# EasyEDA Pro project Tb66_and_DRV88_Teensy_LFR_PCB.epro, board PCB18
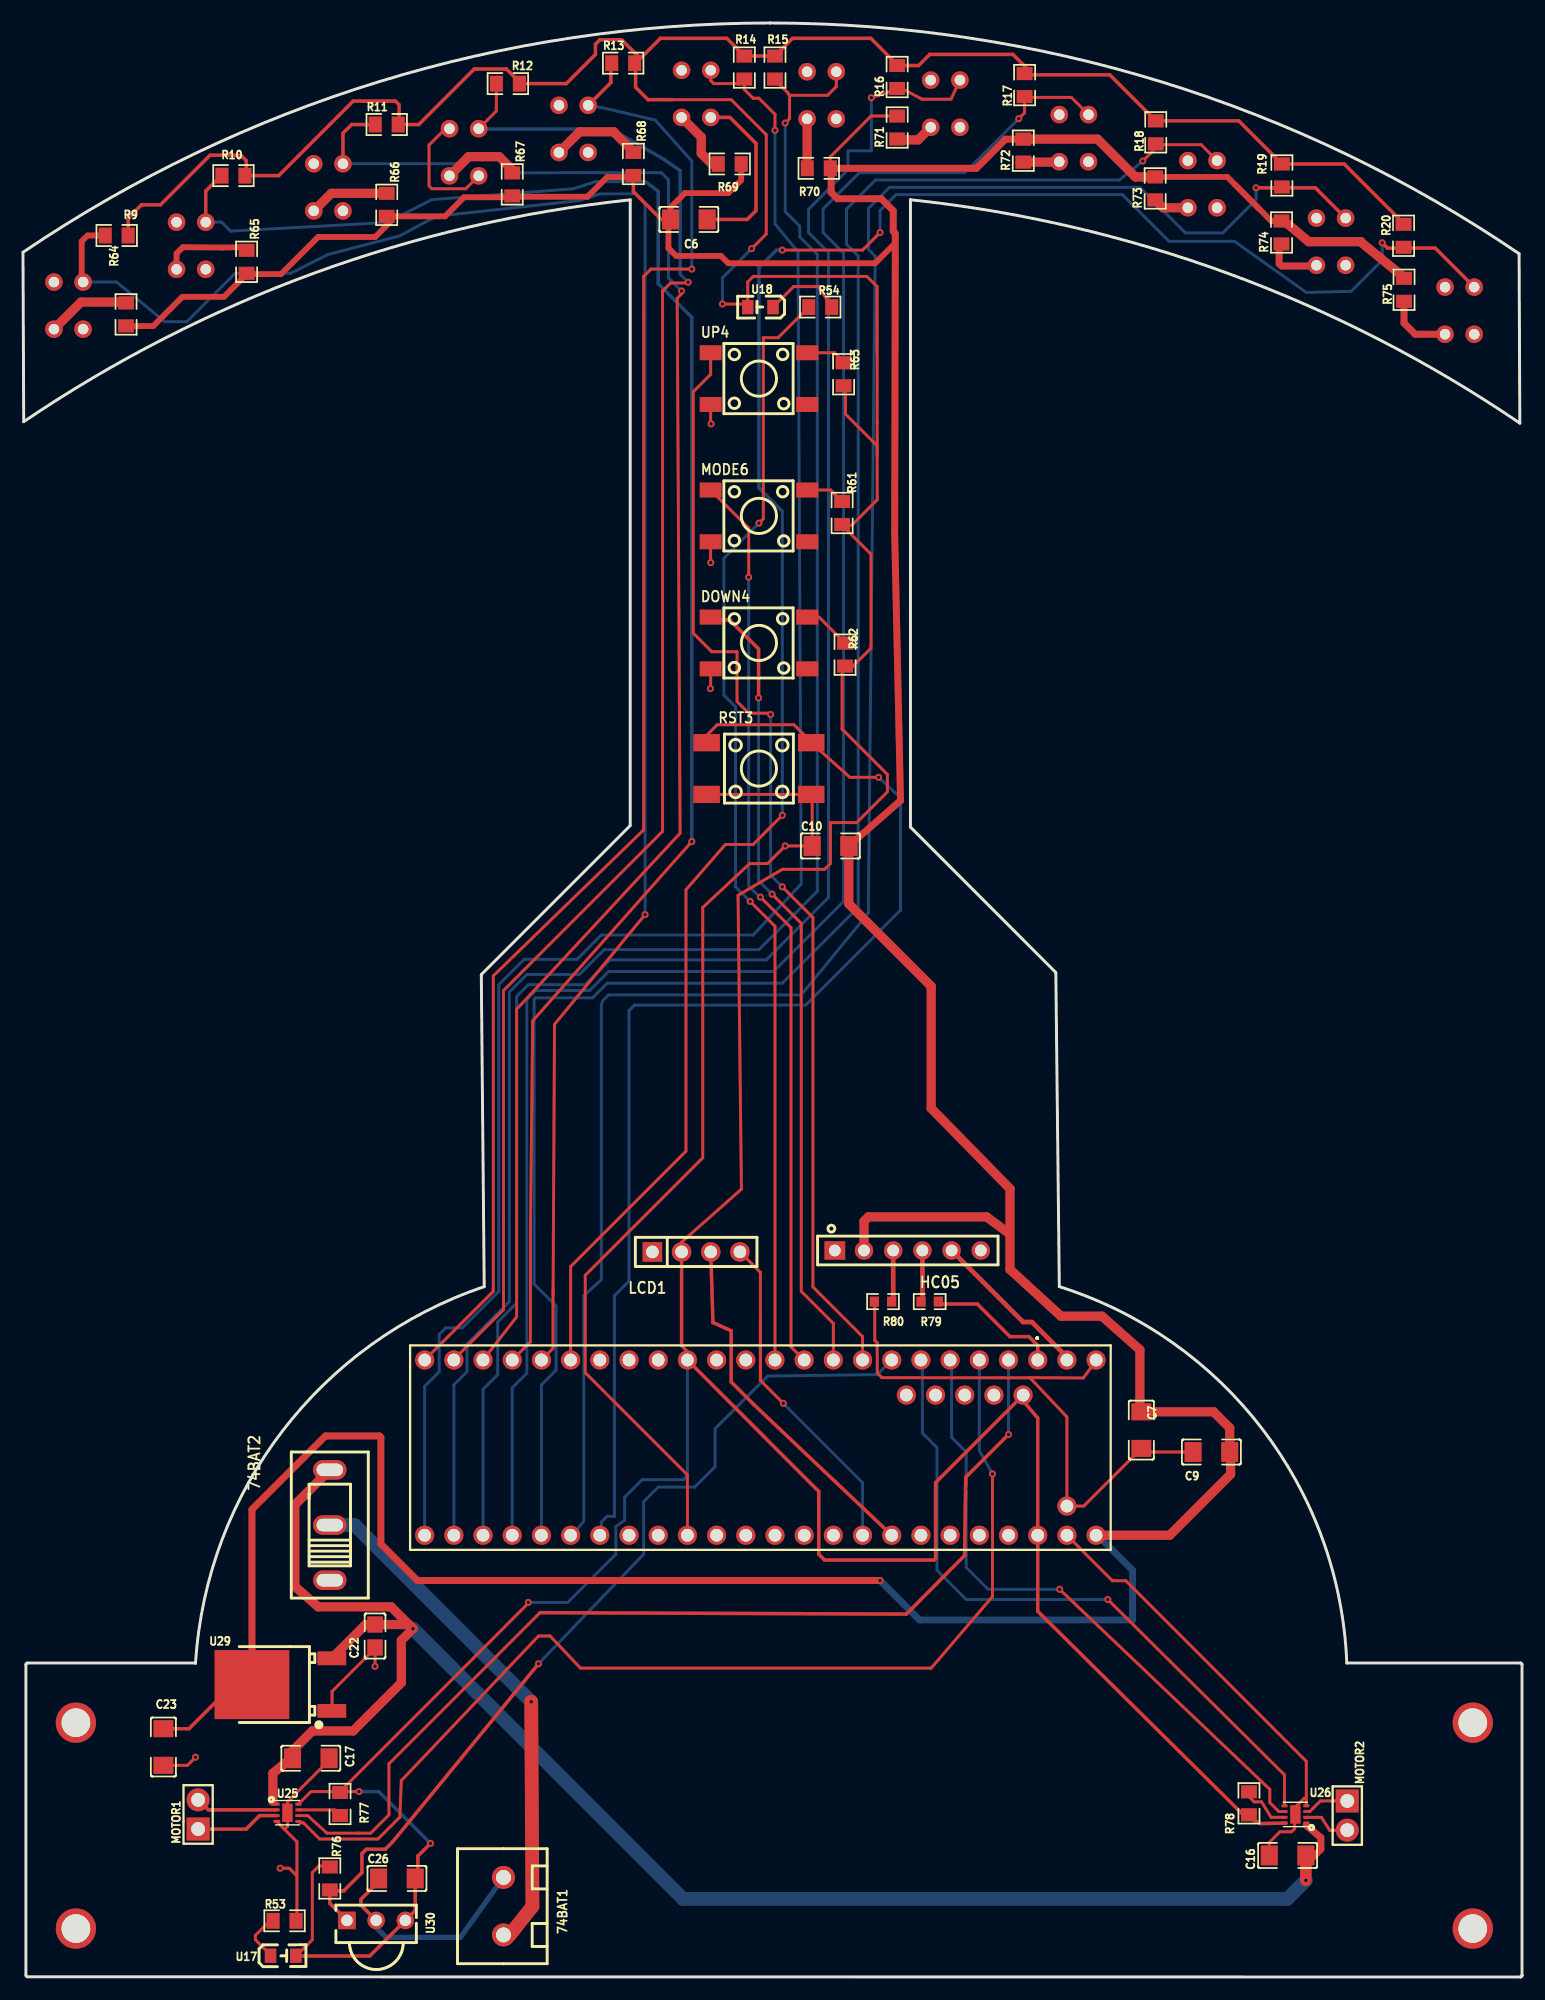
[diagram p6: board, top side]
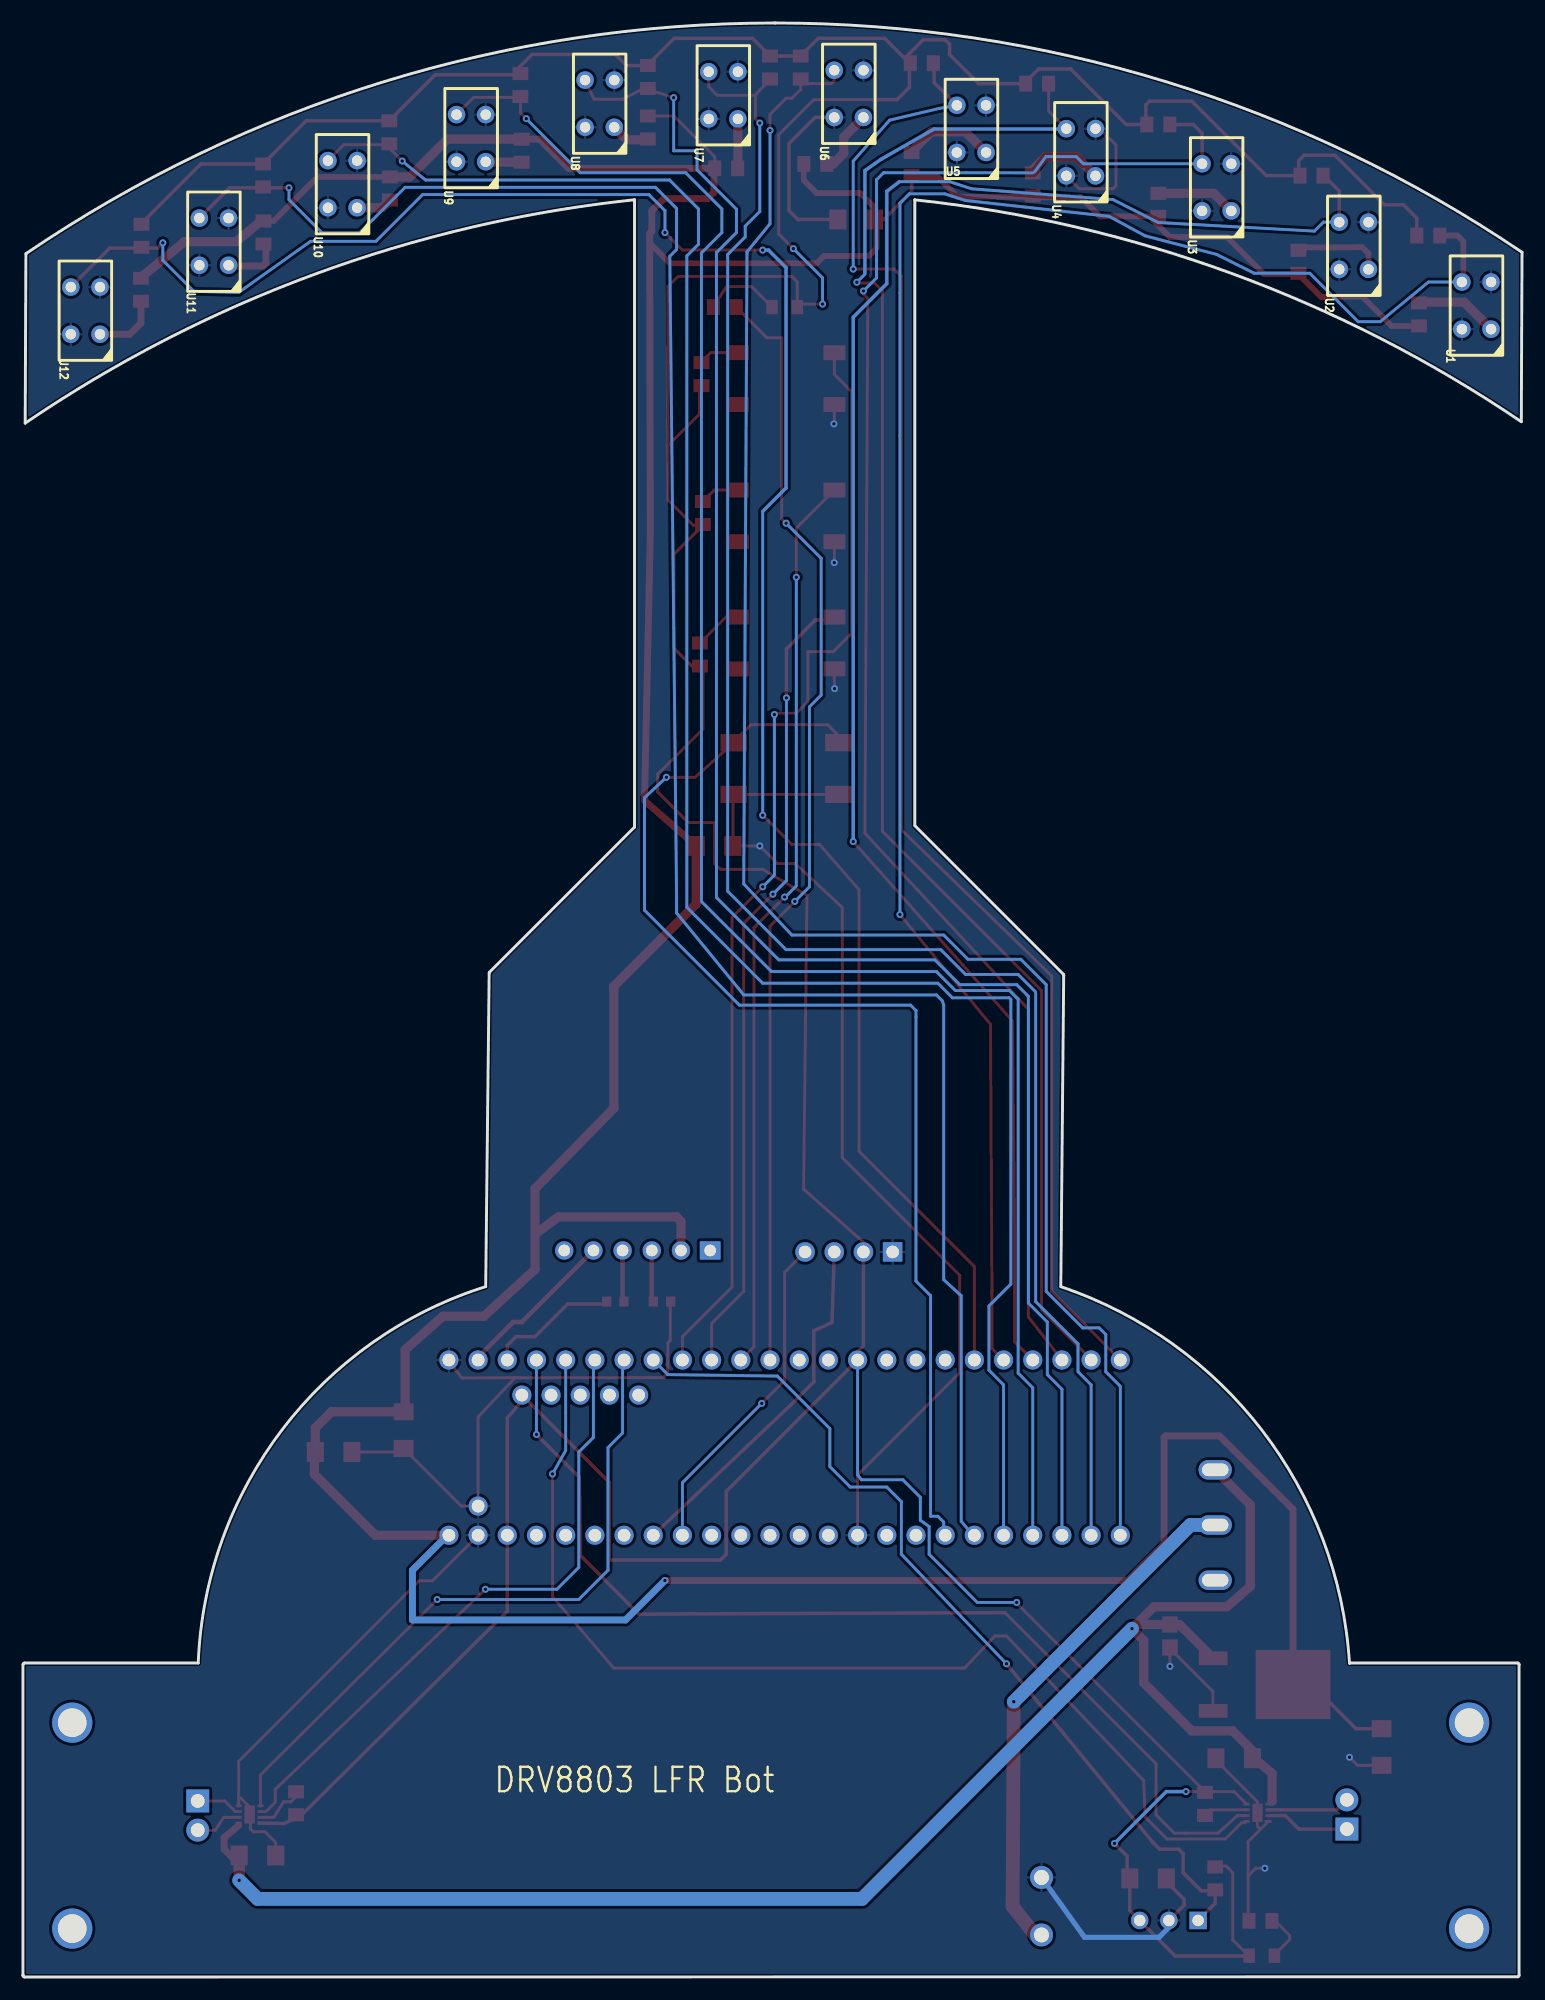
[diagram p7: board, bottom side, seen from below]

Outline 130.43 x 169.93 mm; copper layers: Top Layer, Bottom Layer. Coordinates in mm from the lower left corner of the outline.
Outline path: 0,149.99 arc(31,164.83) 64.99,169.93 arc(99.09,164.8) 130.18,149.86 130.24,135.13 arc(104.93,148.12) 77.22,154.55 77.22,100 89.83,87.39 arc(89.86,87.35) 89.87,87.3 90.17,60.04 arc(107.85,47.63) 115.18,27.3 130.3,27.3 arc(130.39,27.27) 130.43,27.18 130.43,0.18 arc(130.43,0.17) 130.43,0.15 arc(130.43,0.14) 130.43,0.13 arc(130.39,0.04) 130.3,0 0.38,0.02 arc(0.29,0.06) 0.25,0.15 0.25,27.18 arc(0.29,27.27) 0.38,27.3 14.99,27.3 arc(15,27.3) 15.01,27.3 15.01,27.3 arc(22.59,47.49) 40.13,60.03 39.88,87.12 arc(39.88,87.12) 39.88,87.12 arc(39.89,87.17) 39.91,87.21 52.83,100.13 52.83,154.55 arc(25.26,148.15) 0.06,135.25 0,149.99
Stack: Top Layer 0.035mm / Dielectric1 1.51mm FR4 er 4.5 / Bottom Layer 0.035mm

## Design rules (mm)
template: JLCPCB Capability(Two Layers Board)
spacing copperThickness1oz (default): track to track 0.102, other pairs 0.152 to 0.3
spacing copperThickness2oz: track to track 0.203, other pairs 0.152 to 0.3
track width copperThickness1oz (default): min 0.127, default 0.254, max 2.54
track width copperThickness2oz: min 0.203, default 0.254, max 2.54
differential pair differentialPair (default): width min 0.127, default 0.254, max 2.54; gap min 0.152, default 0.152
via viaSize (default): diameter min 0.5, default 0.61, max 10; hole min 0.3, default 0.305, max 6.3

## Placement (name value [footprint] x y rotation side)
74BAT1  7.4V BAT  [CONN-TH_WJ126V-5.0-2P]  41.81 6.16 180 top
74BAT2  SS12D10G4 071  [SW-TH_SHOU-HAN_SS12D10G4]  26.7 39.3 90 top
C6  100nF  [C1206]  57.94 152.84 180 top
C7  100nF  [C1206]  97.31 47.56 90 top
C9  100nF  [C1206]  103.4 45.66 0 top
C10  100nF  [C1206]  70.26 98.36 0 top
C16  100nF  [C1206]  110.03 10.57 0 top
C17  100nF  [C1206]  25.04 19.02 180 top
C22  10uF  [C0805]  30.63 29.65 90 top
C23  47uF  [C1206]  12.22 20 90 top
C26  100nF  [C1206]  32.54 8.57 0 top
DOWN4  TS-1002S-05026C  [KEY-SMD_4P-L6.0-W6.0-P4.50-LS9.0]  64.03 116.01 0 top
HC05  HC-05  [HDR-TH_6P-P2.54-V-F]  76.99 63.18 0 top
LCD1  LCD  [HDR-TH_4P-P2.54-V-F]  58.57 63.05 0 top
MODE6  TS-1002S-05026C  [KEY-SMD_4P-L6.0-W6.0-P4.50-LS9.0]  64.03 127.06 0 top
MOTOR1  MOTOR1  [HDR-TH_2P-P2.54-V-M]  15.24 14.13 90 top
MOTOR2  MOTOR2  [HDR-TH_2P-P2.54-V-M]  115.23 14.04 270 top
NOREF  -  [Pad_e396]  126.14 4.21 0 top
NOREF#2  -  [Pad_e395]  4.6 22.12 0 top
NOREF#3  -  [Pad_e397]  126.14 22.12 0 top
NOREF#4  -  [Pad_e394]  4.6 4.21 0 top
R9  47kΩ  [R0805]  8.15 151.45 180 top
R10  47kΩ  [R0805]  18.31 156.65 0 top
R11  47kΩ  [R0805]  31.65 161.1 0 top
R12  47kΩ  [R0805]  42.19 164.65 180 top
R13  47kΩ  [R0805]  52.22 166.43 0 top
R14  47kΩ  [R0805]  62.76 166.05 90 top
R15  47kΩ  [R0805]  65.43 166.05 270 top
R16  47kΩ  [R0805]  76.06 165.23 90 top
R17  47kΩ  [R0805]  87.15 164.53 90 top
R18  47kΩ  [R0805]  98.56 160.42 270 top
R19  47kΩ  [R0805]  109.54 156.66 90 top
R20  47kΩ  [R0805]  120.12 151.42 90 top
R53  470Ω  [R0805]  22.76 4.89 180 top
R54  470Ω  [R0805]  69.37 145.22 0 top
R61  10kΩ  [R0805]  71.27 127.32 270 top
R62  10kΩ  [R0805]  71.53 115 90 top
R63  10kΩ  [R0805]  71.4 139.38 270 top
R64  187Ω  [R0805]  8.97 144.58 270 top
R65  187Ω  [R0805]  19.46 149.16 270 top
R66  187Ω  [R0805]  31.65 154.11 270 top
R67  187Ω  [R0805]  42.57 155.89 270 top
R68  187Ω  [R0805]  53.11 157.67 270 top
R69  187Ω  [R0805]  61.49 157.67 0 top
R70  187Ω  [R0805]  69.24 157.29 0 top
R71  187Ω  [R0805]  76.06 160.84 90 top
R72  187Ω  [R0805]  87.04 158.82 90 top
R73  187Ω  [R0805]  98.51 155.54 90 top
R74  187Ω  [R0805]  109.51 151.71 90 top
R75  187Ω  [R0805]  120.16 146.73 90 top
R76  10kΩ  [R0805]  26.7 8.57 90 top
R77  10kΩ  [R0805]  27.58 15.05 90 top
R78  10kΩ  [R0805]  106.67 15.1 270 top
R79  1K  [R0603]  78.89 58.74 180 top
R80  2K  [R0603]  74.83 58.74 180 top
RST3  -  [SW-SMD_4P-L6.0-W6.0-P4.50-LS9.0-2]  64.03 105.09 180 top
U1  LTH1550-01  [OPTO-TH_4P-L8.7-W4.5-P4.10_LTH1550-01]  3.96 145.35 90 bottom
U2  LTH1550-01  [OPTO-TH_4P-L8.7-W4.5-P4.10_LTH1550-01]  14.63 150.56 90 bottom
U3  LTH1550-01  [OPTO-TH_4P-L8.7-W4.5-P4.10_LTH1550-01]  26.57 155.64 90 bottom
U4  LTH1550-01  [OPTO-TH_4P-L8.7-W4.5-P4.10_LTH1550-01]  38.38 158.69 90 bottom
U5  LTH1550-01  [OPTO-TH_4P-L8.7-W4.5-P4.10_LTH1550-01]  47.9 160.72 90 bottom
U6  LTH1550-01  [OPTO-TH_4P-L8.7-W4.5-P4.10_LTH1550-01]  58.57 163.76 90 bottom
U7  LTH1550-01  [OPTO-TH_4P-L8.7-W4.5-P4.10_LTH1550-01]  69.49 163.64 90 bottom
U8  LTH1550-01  [OPTO-TH_4P-L8.7-W4.5-P4.10_LTH1550-01]  80.25 162.91 90 bottom
U9  LTH1550-01  [OPTO-TH_4P-L8.7-W4.5-P4.10_LTH1550-01]  91.44 159.91 90 bottom
U10  LTH1550-01  [OPTO-TH_4P-L8.7-W4.5-P4.10_LTH1550-01]  102.63 155.91 90 bottom
U11  LTH1550-01  [OPTO-TH_4P-L8.7-W4.5-P4.10_LTH1550-01]  113.81 150.91 90 bottom
U12  LTH1550-01  [OPTO-TH_4P-L8.7-W4.5-P4.10_LTH1550-01]  125 144.91 90 bottom
U17  YLED0805R  [LED0805-RD]  22.64 1.85 0 top
U18  YLED0805R  [LED0805-RD]  64.16 145.22 180 top
U25  DRV8838DSGR  [WSON-8_L2.0-W2.0-P0.50-TL-EP]  23.01 14.29 0 top
U26  DRV8838DSGR  [WSON-8_L2.0-W2.0-P0.50-TL-EP]  110.71 14.14 180 top
U29  ZLDO1117QK50TC  [TO-252-3_L6.6-W6.1-P4.57-LS9.9-BR-CW]  23.4 25.43 0 top
U30  XL-IRM1838B  [OPTO-TH_3P-L7.0-W5.6-P2.54-L]  30.73 4.92 0 top
U31  TEENSY 4.1  [TEENSY41 solved]  88.29 53.66 180 top
UP4  TS-1002S-05026C  [KEY-SMD_4P-L6.0-W6.0-P4.50-LS9.0]  64.03 139 0 top

## Footprints (pads in the part's own frame, mm; a bottom-side part is the same pattern mirrored in y, then rotated)
C0805
  rect 1.41x1.35 smd: 1(-1,0) 2(1,0)
C1206
  rect 1.485x1.728 smd: 1(-1.593,0) 2(1.593,0)
CONN-TH_WJ126V-5.0-2P
  round 2 hole 1.3: 1(0,2.501) 2(0,-2.501)
HDR-TH_2P-P2.54-V-M
  rect 2x2 hole 1.2: 1(-1.27,0)
  round 2 hole 1.2: 2(1.27,0)
HDR-TH_4P-P2.54-V-F
  rect 1.7x1.7 hole 1.1: 1(-3.81,0)
  round 1.7 hole 1.1: 2(-1.27,0) 3(1.27,0) 4(3.81,0)
HDR-TH_6P-P2.54-V-F
  rect 1.8x1.6 hole 1.02: 1(-6.35,0)
  round 1.6 hole 1.02: 2(-3.81,0) 3(-1.27,0) 4(1.27,0) 5(3.81,0) 6(6.35,0)
KEY-SMD_4P-L6.0-W6.0-P4.50-LS9.0
  rect 1.9x1.3 smd: 1(-4.2,2.25) 2(4.2,2.25) 3(-4.2,-2.25) 4(4.2,-2.25)
LED0805-RD
  rect 1x1.25 smd: 1(-1.1,0) 2(1.1,0)
OPTO-TH_3P-L7.0-W5.6-P2.54-L
  rect 1.524x1.524 hole 1: 1(-2.54,0)
  round 1.524 hole 1: 2(0,0) 3(2.54,0)
OPTO-TH_4P-L8.7-W4.5-P4.10_LTH1550-01
  round 1.524 hole 0.914: 1(-2.05,1.27) 2(2.05,1.27) 3(-2.05,-1.27) 4(2.05,-1.27)
Pad_e394
  round 3.5 hole 2.5: 1(0,0)
Pad_e395
  round 3.5 hole 2.5: 1(0,0)
Pad_e396
  round 3.5 hole 2.5: 2(0,0)
Pad_e397
  round 3.5 hole 2.5: 1(0,0)
R0603
  rect 0.806x0.864 smd: 1(-0.753,0) 2(0.753,0)
R0805
  rect 1.133x1.377 smd: 1(-1,0) 2(1,0)
SW-SMD_4P-L6.0-W6.0-P4.50-LS9.0-2
  rect 2.3x1.5 smd: 1(-4.55,2.25) 2(4.55,2.25) 3(-4.55,-2.25) 4(4.55,-2.25)
SW-TH_SHOU-HAN_SS12D10G4
  oval 1.7x2.9 hole 1.1x2.3: 1(-4.8,0) 2(0,0) 3(4.8,0)
TEENSY41 solved
  round 1.665 hole 1.11: 0(-2.54,0) 1(0,0) 2(2.54,0) 3(5.08,0) 4(7.62,0) 5(10.16,0) 6(12.7,0) 7(15.24,0) 8(17.78,0) 9(20.32,0) 10(22.86,0) 11(25.4,0) 12(27.94,0) 13(27.94,15.24) 14(25.4,15.24) 15(22.86,15.24) 16(20.32,15.24) 17(17.78,15.24) 18(15.24,15.24) 19(12.7,15.24) 20(10.16,15.24) 21(7.62,15.24) 22(5.08,15.24) 23(2.54,15.24) 24(33.02,0) 25(35.56,0) 26(38.1,0) 27(40.64,0) 28(43.18,0) 29(45.72,0) 30(48.26,0) 31(50.8,0) 32(53.34,0) 33(53.34,15.24) 33V(0,15.24) 33V(30.48,0) 34(50.8,15.24) 35(48.26,15.24) 36(45.72,15.24) 37(43.18,15.24) 38(40.64,15.24) 39(38.1,15.24) 40(35.56,15.24) 41(33.02,15.24) 48(11.43,3.05) 49(8.89,3.05) 50(6.35,3.05) 51(3.81,3.05) 52(1.27,3.05) GND(-5.08,0) GND1(-2.54,15.24) GND2(-2.54,12.7) GND3(30.48,15.24) VIN1(-5.08,15.24)
TO-252-3_L6.6-W6.1-P4.57-LS9.9-BR-CW
  rect 2.5x1.2 smd: 1(3.475,-2.286) 3(3.475,2.286)
  rect 6.5x6 smd: 2(-3.475,0)
WSON-8_L2.0-W2.0-P0.50-TL-EP
  rect 0.521x0.25 smd: 1(-0.95,0.75) 2(-0.95,0.25) 3(-0.95,-0.25) 4(-0.95,-0.75) 5(0.95,-0.75) 6(0.95,-0.25) 7(0.95,0.25) 8(0.95,0.75)
  rect 0.9x1.6 smd: 9(0,0)

## Nets
+3.3V: C26.2 LCD1.2 R9.1 R10.2 R11.2 R12.1 R13.2 R14.2 R15.1 R16.2 R17.2 R18.1 R19.2 R20.2 R61.2 R62.1 R63.2 R76.2 R77.2 R78.2 U17.2 U18.2 U25.8 U26.8 U30.3 U31.33V U31.52
+5V: C6.2 C7.2 C9.2 C10.2 C23.2 HC05.2 R64.2 R65.2 R66.2 R67.2 R68.2 R69.2 R70.2 R71.2 R72.2 R73.2 R74.2 R75.2 U29.2 U31.VIN1
+7.4V: 74BAT2.3 C16.2 C17.2 C22.2 U25.1 U26.1 U29.3
GND: 74BAT1.2 C6.1 C7.1 C9.1 C10.1 C16.1 C17.1 C22.1 C23.1 C26.1 DOWN4.3 LCD1.1 MODE6.3 R53.1 R80.2 RST3.1 RST3.2 U1.1 U1.4 U2.1 U2.4 U3.1 U3.4 U4.1 U4.4 U5.1 U5.4 U6.1 U6.4 U7.1 U7.4 U8.1 U8.4 U9.1 U9.4 U10.1 U10.4 U11.1 U11.4 U12.1 U12.4 U25.4 U25.9 U26.4 U26.9 U29.1 U30.2 U31.GND U31.GND1 U31.GND2 U31.GND3 UP4.3
7: U31.7 UP4.1
8: DOWN4.1 U31.8
9: MODE6.1 U31.9
10: R54.1 U31.10
27(A11): R20.1 U12.2 U31.27
28(A0): R9.2 U1.2 U31.28
29(A1): R10.1 U2.2 U31.29
30(A2): R11.1 U3.2 U31.30
31(A3): R12.2 U4.2 U31.31
32(A4): R13.1 U5.2 U31.32
33(A5): R14.1 U6.2 U31.33
34(A6): R15.2 U7.2 U31.34
35(A7): R16.1 U8.2 U31.35
36(A8): R17.1 U9.2 U31.36
37(A9): R18.2 U10.2 U31.37
38(A10): R19.1 U11.2 U31.38
BTRX(0): HC05.5 U31.0
BTTX(1): R79.1 U31.1
IRSIGNAL_IN(6): R76.1 U30.1 U31.6
M1P(2): U25.6 U31.2
M1S(3): U25.5 U31.3
M1SLEEP(3.3V): R77.1 U25.7
M2P(4): U26.6 U31.4
M2S(5): U26.5 U31.5
M2SLEEP(3.3V): R78.1 U26.7
ON/OFF: U31.49
RESET: RST3.3 RST3.4 U31.39
SCL(19): LCD1.3 U31.19
SDA(18): LCD1.4 U31.18
$1N12804: R68.1 U5.3
$1N12805: R67.1 U4.3
$1N12816: R65.1 U2.3
$1N12817: R66.1 U3.3
$1N12824: R64.1 U1.3
$1N12829: HC05.4 R79.2
$1N12830: HC05.3 R80.1
$1N12842: R63.1 UP4.2
$1N12844: DOWN4.2 R62.2
$1N12845: MODE6.2 R61.1
$1N12852: R54.2 U18.1
$1N12862: R73.1 U10.3
$1N12863: R74.1 U11.3
$1N12864: R75.1 U12.3
$1N12875: R71.1 U8.3
$1N12876: R72.1 U9.3
$1N12883: R69.1 U6.3
$1N12886: 74BAT1.1 74BAT2.2
$1N12898: R53.2 U17.1
$1N12918: R70.1 U7.3
$1N15829: MOTOR1.2 U25.2
$1N15830: MOTOR1.1 U25.3
$1N16024: MOTOR2.2 U26.2
$1N16025: MOTOR2.1 U26.3

Pads without a net: 74BAT2 1; DOWN4 4; HC05 1 6; MODE6 4; NOREF 2; NOREF#2 1; NOREF#3 1; NOREF#4 1; U31 11 12 13 14 15 16 17 20 21 22 23 24 25 26 40 41 48 50 51; UP4 4

## Via types
v1: diameter 0.61, hole 0.305, Top Layer to Bottom Layer, 46 vias

## Routing (per net, layer and track width the routed paths; a pad name or vN(x,y) marks a point on that pad's centre or on a via; arc(x,y) is an arc through that point)
+3.3V: length 497.2
  Top Layer w0.254: 23.77,1.83 25.17,3.23 25.17,9.08 25.74,9.65 26.7,9.65 ; U25.8 25.05,16.12 27.58,16.12 ; 27.58,16.12 v1(29.23,16.12) ; 27.58,16.12 43.97,32.51 v1(43.97,32.57) ; 56.47,163.26 61.62,163.26 64.67,160.21 64.67,151.57 63.53,150.43 ; 57.27,54.93 57.81,54.38 U31.33V ; 57.29,63.05 57.29,63.89 62.51,68.52 62.22,94.07 66.07,96.33 69.75,96.33 70.26,96.84 70.26,100.39 72.54,100.39 75.21,103.06 75.21,104.58 71.27,108.52 71.27,113.92 ; v1(60.86,145.48) 62.8,145.48 U18.2 ; 62.93,145.35 63.06,145.48 63.06,147.41 63.54,147.89 73.43,147.89 74.32,147 74.32,135.19 ; 71.57,138.31 71.57,135.91 74.32,133.16 74.32,132.3 ; 71.53,113.92 72.15,113.92 73.79,115.57 73.79,123.72 71.27,126.24 72.1,126.24 74.32,128.46 74.32,135.35 ; U31.52 87.02,50.1
  Top Layer w0.3: R9.1 9.15,152.95 10.31,154.11 11.96,154.11 16.28,158.43 18.95,158.43 19.43,157.95 19.43,156.65 ; R10.2 22.25,156.65 28.73,163.13 32.41,163.13 32.72,162.82 32.72,161.1 34.44,161.1 39.27,165.92 ; 23.77,1.83 30.18,1.83 U30.3 34.13,5.78 C26.2 ; v1(35.46,11.62) 34.36,10.52 34.36,8.57 ; 39.27,165.92 39.52,165.92 ; 39.27,165.92 42.06,165.92 43.26,164.72 43.26,164.65 47.27,164.65 49.81,167.19 49.81,168.08 50.19,168.46 52.1,168.46 53.49,167.07 53.49,166.94 ; 56.47,163.26 54.38,163.26 53.3,164.34 53.3,166.43 55.46,168.59 61.24,168.59 62.76,167.07 R14.2 65.41,167.05 66.95,168.59 73.77,168.59 76.06,166.3 ; LCD1.2 57.3,54.98 ; U31.33V 69.24,42.23 69.24,36.77 69.75,36.26 79.27,36.26 79.4,36.38 79.4,42.99 U31.52 87.02,50.1 88.29,48.61 U31.33V 88.29,31.81 106.25,14.03 107.71,13.34 109.89,13.39 ; R16.2 77.93,166.23 78.89,167.19 86.13,167.19 87.37,165.96 87.37,165.42 ; 87.14,165.42 94.56,165.42 R18.1 105.78,161.42 R19.2 114.96,157.67 120.12,152.5
  Bottom Layer w0.254: v1(43.97,32.57) 47.4,32.57 51.59,36.77 51.59,39.18 52.35,39.72 52.35,41.72 53.87,43.24 57.48,43.24 57.81,43.66 57.81,53.91 ; 60.86,145.48 60.86,147.76 v1(63.4,150.3)
  Bottom Layer w0.3: v1(29.23,16.12) 30.95,16.12 v1(35.46,11.62)
+5V: length 447.1
  Top Layer w0.254: R70.2 70.24,158.29 73.79,161.84 R71.2
  Top Layer w0.3: C23.2 14.44,21.59 17.68,24.83 ; R68.2 53.11,155.26 55.52,152.84 C6.2
  Top Layer w0.5: 8.97,143.34 9.2,143.57 11.33,143.57 13.87,146.11 17.48,146.11 19.46,148.09 ; 19.83,148.09 22.45,148.09 25.68,151.32 30.64,151.32 31.9,152.58 31.9,153.04 ; R66.2 36.72,153.11 38.38,154.77 42.45,154.77 R67.2 ; 42.57,154.82 49.12,154.82 50.83,156.53 52.98,156.53 53.11,156.65 ; 56.16,153.09 56.16,150.35 56.84,149.67 60.73,149.67 61.37,149.03 74.14,149.03 75.9,150.79 ; C6.2 56.34,153.89 57.59,155.13 61.37,155.13 62.49,156.26 R69.2 ; R73.2 104.79,156.54 107.55,153.78 ; 105.44,155.89 108.62,152.71 109.62,152.71
  Top Layer w0.6: U29.2 19.92,40.66 26.31,47.05 31.01,47.05 31.14,46.93 31.14,37.65 34.32,34.48 v1(74.57,34.48) ; R70.2 82.96,157.29 85.49,159.82 R72.2 ; 70.32,157.08 70.32,155.2 70.87,154.65 74.68,154.65 75.72,153.61 75.72,151.81 75.9,151.63 75.9,149.03 75.84,125.54 76.35,102.3 C10.2
  Top Layer w0.8: 70.32,157.29 R70.2 ; C10.2 71.85,93.32 79.02,86.15 ; 79.02,86.15 79.02,85.95 ; 79.02,86.15 79.02,75.54 85.88,68.55 85.88,61.53 90.32,57.47 93.88,57.47 97.18,54.55 97.18,49.53 97.05,49.41 ; HC05.2 73.18,65.72 73.56,66.1 83.85,66.1 85.82,64.63 ; R72.2 93.5,159.82 96.78,156.54 R73.2 ; 93.5,38.42 99.77,38.42 105.07,43.72 105.07,45.66 ; C7.2 103.59,49.15 105,47.75 C9.2 ; R74.2 109.73,152.71 111.87,150.91 116.41,150.91 116.48,150.81 120.16,147.8
  Bottom Layer w0.6: v1(74.57,34.48) 78,31.05 96.55,31.05 96.55,35.37 93.5,38.42
+7.4V: length 147.7
  Top Layer w0.6: 111.66,13.18 112.93,12.12 112.93,11.11 112.17,10.35
  Top Layer w0.8: 21.74,15.28 21.74,17.72 23.58,19.24 ; 23.27,19.49 25.17,21.4 28.73,21.4 32.92,25.59 32.92,29.27 v1(33.93,30.29) ; 74BAT2.3 23.65,41.06 23.65,33.97 25.68,32.19 32.03,32.19 v1(33.93,30.29) ; U29.3 29.81,30.65 C22.2 33.57,30.65 v1(33.93,30.29)
  Top Layer w1: C16.2 v1(111.62,8.41)
  Bottom Layer w1.2: v1(33.93,30.29) 57.43,6.79 110.01,6.79 v1(111.62,8.41)
GND: length 258.5
  Top Layer w0.254: C23.1 14.31,18.41 v1(15.01,19.11) ; 22.26,13.54 U25.4 23.83,11.77 23.83,4.89 ; 22.82,12.9 23.02,13.1 23.02,13.67 ; 23.01,14.93 23.01,15.23 26.76,18.99 ; 22.5,9.46 23.17,9.46 23.83,8.79 ; 26.9,23.13 26.9,24.84 30.63,28.58 v1(30.63,27.02) ; 37.11,160.74 36.75,160.74 35.33,159.32 35.33,155.76 35.59,155.51 38.52,155.51 U4.1 ; 57.94,38.42 57.81,38.54 57.81,43.66 48.92,52.55 48.92,61.02 59.14,71.25 59.14,93.01 63.23,96.83 64.79,96.83 v1(66.32,98.36) C10.1 68.66,102.76 RST3.1 ; RST3.2 68.7,102.84 68.73,102.81 ; C6.1 60.48,152.84 ; UP4.3 59.83,135.1 v1(59.87,135.07) ; MODE6.3 59.83,123.01 v1(59.84,123) ; 59.83,113.54 59.83,112.06 v1(59.81,112.04) ; 74.11,58.73 74.11,55.36 74.32,55.15 74.33,52.55 74.73,52.12 87.62,52.11 90.83,48.7 U31.GND2 ; 87.6,52.12 92.25,52.09 93.37,53.58 U31.GND ; U31.GND1 94.79,34.46 95.95,34.46 111.66,18.76 U26.4 ; 90.96,40.96 92.3,40.96 C7.1 97.62,45.66 C9.1 ; 108.44,11.03 108.44,11.7 109.37,12.64 110.39,12.64 110.64,12.89 110.64,13.52 110.77,13.65 ; 110.71,14.78 111.47,15.55 111.66,15.55
  Top Layer w0.3: U30.2 29.41,6.24 29.41,6.76 30.94,8.3 C26.1 ; 59.84,161.72 61.51,161.72 63.78,159.45 63.78,153.61 63.02,152.84 60,152.84
  Bottom Layer w0.45: U30.2 30.73,4.31 31.59,3.45 38.06,3.45 74BAT1.2
  vias: v1(22.38,9.46)
7: length 96.5
  Top Layer w0.254: 59.83,141.1 59.83,139.37 58.32,137.86 58.32,116.86 59.93,115.25 62.13,115.25 62.13,110.92 63.14,109.9 64.94,109.9 v1(65.05,109.79) ; v1(66.07,94.8) 68.73,92.14 68.73,60.01 73.05,55.69 U31.7
  Bottom Layer w0.254: v1(65.05,109.79) 65.05,95.82 v1(66.07,94.8)
8: length 69.9
  Top Layer w0.254: v1(65.18,94.17) 67.72,91.63 67.72,59.63 70.51,56.83 U31.8
  Top Layer w0.3: DOWN4.1 60.09,118.01 61.54,118.01 ; 61.48,118.01 64,115.49 v1(64,111.23)
  Bottom Layer w0.254: v1(64,111.23) 64,95.34 v1(65.18,94.17)
9: length 78.9
  Top Layer w0.254: MODE6.1 63.14,126 v1(63.14,121.73) ; v1(64.16,93.91) 66.83,91.25 66.83,54.8 U31.9
  Bottom Layer w0.254: v1(63.14,121.73) 63.14,94.88 64.03,93.99
10: length 97.2
  Top Layer w0.254: 63.27,93.53 65.43,91.38 U31.10 ; v1(64.03,126.43) 64.41,126.81 64.41,142.56 65.7,142.56 R54.1
  Bottom Layer w0.254: 63.27,93.53 v1(63.27,93.54) 62,94.81 62,110.46 60.98,111.48 60.98,123.38 v1(64.03,126.43)
27(A11): length 178.1
  Top Layer w0.254: U31.27 47.65,61.78 57.68,71.82 57.68,94.55 61.11,98.49 63.53,98.49 v1(66.07,101.03) ; v1(66.07,150.18) 73.05,150.18 v1(74.57,151.7)
  Top Layer w0.3: v1(118.26,150.81) 118.72,150.35 122.88,150.35 U12.2
  Bottom Layer w0.254: v1(66.07,101.03) 66.07,127.46 ; v1(74.57,151.7) 74.57,153.61 75.96,155 95.66,155 99.72,150.94 105.41,150.94 111.66,146.49 115.56,146.59 118.26,149.29 v1(118.26,150.81)
  Bottom Layer w0.3: 66.07,127.46 64.03,129.49 64.03,148.65 65.56,150.18 v1(66.07,150.18)
28(A0): length 163.8
  Top Layer w0.254: U31.28 46.12,54.67 46.12,59.75 46.13,59.75 ; 46.12,59.31 46.25,82.85 v1(54.13,92.39)
  Top Layer w0.5: U1.2 5.11,147.53 5.11,150.94 5.61,151.45 R9.2
  Bottom Layer w0.254: U1.2 8.14,147.4 12.34,143.95 14.25,143.95 18.46,148.16 23.28,148.16 26.57,149.8 32.79,151.42 35.92,153.11 48.43,154.49 50.22,155.07 53.3,155.07 54.13,154.24 ; 54.13,154.24 53.92,154.45 ; 54.13,154.24 v1(54.13,92.39)
29(A1): length 154.3
  Top Layer w0.254: 42.32,53.91 U31.29 44.15,55.24 44.15,64.83 44.35,83.15 v1(58.19,98.74)
  Top Layer w0.3: 17.24,156.65 15.9,155.31 U2.2
  Bottom Layer w0.254: U2.2 17.28,152.61 18.06,151.83 31.65,152.58 35.59,154.57 47.89,155.51 49.81,156.13 54.17,156.13
  Bottom Layer w0.3: 54.17,156.13 55.27,155.28 55.27,147.26 58.19,144.33 v1(58.19,98.74)
30(A2): length 153.2
  Top Layer w0.254: U31.30 42.95,57.4 42.95,84.17 43.33,84.56 57.18,99.47 56.92,145.99 57.3,146.37 v1(57.3,146.62)
  Top Layer w0.3: U3.2 27.84,160.34 28.6,161.1 R11.1
  Bottom Layer w0.254: U3.2 38.16,157.69 38.78,158.3 41.43,158.3 42.41,156.96 ; 42.57,156.89 48.35,156.91 55.44,156.91 ; 55.4,156.91 55.55,156.91 56.16,156.3 ; 56.16,156.3 56.16,147.76 ; 56.16,156.3 56.16,147.76 ; 56.16,147.76 57.05,146.87
31(A3): length 136.3
  Top Layer w0.254: 37.44,53.66 41.81,58.03 41.81,85.79 55.65,99.63 55.65,146.62 56.35,147.32 57.81,147.32 v1(57.88,147.38) ; 39.65,160.74 41.19,162.28 R12.2
  Bottom Layer w0.254: 57.18,148.27 57.18,148.08 v1(57.88,147.38) ; 57.94,147.51 57.94,147.38
  Bottom Layer w0.3: 39.65,160.74 39.68,160.7 51.15,160.7 ; 51.14,160.72 55.78,158.07 57.18,157.09 57.18,148.27
32(A4): length 131.3
  Top Layer w0.254: U31.32 40.92,59.63 40.92,87.06 54,99.76 54,147.89 54.64,148.53 v1(58.19,148.52)
  Top Layer w0.3: U5.2 51.15,164.74 51.15,166.43
  Bottom Layer w0.254: U5.2 50.7,162.5 55.02,161.48 58.19,157.92 v1(58.19,148.52)
33(A5): length 157.5
  Top Layer w0.254: U6.2 59.84,164.91 60.1,164.65 62.64,164.65 62.76,164.78 ; R14.1 62.76,164.15 63.53,163.38 64.03,163.38 65.43,161.99 v1(65.43,160.59)
  Bottom Layer w0.254: U31.33 34.95,51.37 36.21,52.63 36.21,55.88 36.79,56.45 38.22,56.45 41.4,59.63 41.4,86.3 43.6,88.5 48.21,88.5 50.32,90.61 63.53,90.61 67.72,95.06 67.43,150.02 65.43,152.46 65.43,160.55
34(A6): length 157.6
  Top Layer w0.254: 65.43,164.98 66.57,163.83 66.57,163.77 66.7,163.64 ; 66.7,163.64 66.7,161.61 v1(66.32,161.22) ; 66.7,163.64 70.01,163.64 70.76,164.39 U7.2
  Bottom Layer w0.254: U31.34 37.49,51.5 38.63,52.64 38.63,55.05 42.32,58.74 42.32,85.53 ; 42.32,85.66 43.84,87.18 48.41,87.18 50.57,89.34 64.03,89.34 69.11,94.42 69.11,149.79 ; v1(66.32,161.22) 66.32,153.53 67.59,152.26 67.59,151.32 69.11,149.8
35(A7): length 161.6
  Top Layer w0.254: v1(73.81,163.43) 76.06,164.16 76.6,164.16 78.22,163.3 ; 78.22,163.3 78.22,163.3 ; 78.22,163.3 80.75,163.3 U8.2
  Bottom Layer w0.254: U31.35 40.03,51.12 41.3,52.39 41.3,56.96 42.95,58.61 42.95,85.28 43.97,86.3 48.92,86.3 51.08,88.45 64.67,88.45 70.09,93.87 70.09,149.97 70.08,149.97 68.35,151.7 68.35,153.73 71.78,157.16 71.78,158.81 73.81,158.81 v1(73.81,163.43)
36(A8): length 167.7
  Top Layer w0.254: v1(86.64,161.61) 87.15,162.11 87.15,163.45 91.21,163.45 U9.2
  Bottom Layer w0.254: U31.36 42.57,51.24 43.84,52.51 43.84,85.03 44.6,85.79 49.3,85.79 50.95,87.44 65.3,87.44 71.4,93.53 71.4,149.92 69.62,151.7 69.62,153.76 72.77,156.91 81.94,156.91 v1(86.64,161.61)
37(A9): length 175.8
  Top Layer w0.254: v1(97.43,157.92) 98.56,159.05 98.56,159.34 102.51,159.34 103.9,157.96
  Bottom Layer w0.254: U31.37 45.11,51.5 46.38,52.77 46.38,58.36 44.48,60.26 44.48,85.03 44.6,85.15 49.56,85.15 50.83,86.42 66.07,86.42 72.67,93.03 72.67,149.67 71.65,150.68 71.65,153.76 74.17,156.27 95.4,156.27 v1(97.43,157.92)
38(A10): length 183
  Top Layer w0.3: v1(107.29,155.59) 112.45,155.59 U11.2
  Bottom Layer w0.254: 47.78,38.42 48.79,39.63 48.79,59.24 50.32,60.64 50.32,84.52 50.44,84.9 50.95,85.41 67.72,85.41 73.56,92.53 73.56,93.79 74.15,149.64 73.56,150.23 73.56,153.79 75.4,155.64 97.18,155.64 101.14,151.68 104.4,151.68 107.29,154.56 v1(107.29,155.59)
IRSIGNAL_IN(6): length 77.8
  Top Layer w0.3: R76.1 26.7,6.41 U30.1 ; 26.7,7.5 27.91,7.5 29.49,9.08 29.49,10.73 29.87,11.11 31.52,11.11 32.16,11.75 v1(44.86,27.24)
  Bottom Layer w0.254: v1(44.86,27.24) 54,36.77 54,41.34 55.27,42.61 58.45,42.61 60.22,44.39 60.22,47.69 64.8,52.26 74.32,52.39 U31.6
M1P(2): length 90
  Top Layer w0.254: U25.6 24.53,14.04 24.54,14.03 24.79,14.03 ; 24.77,14.04 26.45,12.51 29.36,12.51 ; 29.11,12.51 30.25,12.51 31.84,14.1 31.84,18.54 44.98,31.69
  Top Layer w0.3: 44.98,31.69 76.86,31.56 81.93,36.66 82.03,43.46 v1(85.75,47.18)
  Bottom Layer w0.254: 85.75,47.22 U31.2
M1S(3): length 95
  Top Layer w0.254: 24.09,13.41 24.4,13.41 25.8,12 30.89,12 32.79,13.91 32.92,17.08 44.86,29.65 45.86,29.65 48.51,26.86 79.02,26.86 84.35,33.08 v1(84.35,43.75)
  Bottom Layer w0.254: U31.3 83.21,45.79 v1(84.35,43.75)
M2P(4): length 55.5
  Top Layer w0.254: v1(90.2,33.72) 108.48,16.32 108.48,15.18 109.27,14.39 U26.6
  Bottom Layer w0.254: 80.8,53.66 80.8,46.93 82.07,45.66 82.07,35.62 83.97,33.72 v1(90.2,33.72)
M2S(5): length 59.3
  Top Layer w0.254: 94.26,32.96 109.76,17.58 U26.5
  Bottom Layer w0.254: 78.26,53.66 78.26,47.31 79.53,46.04 79.53,35.37 82.07,32.83 v1(94.39,32.83)
RESET: length 104.7
  Top Layer w0.254: 58.85,107.34 60.41,108.9 67.08,108.9 68.58,107.4 RST3.3 71.95,104.33 v1(74.45,104.33)
  Bottom Layer w0.254: 50.32,38.42 50.32,39.56 50.82,40.07 51.46,40.07 51.46,59.24 52.73,60.51 52.73,84.04 53.2,84.52 68.1,84.52 76.35,92.77 76.35,102.55 v1(74.45,104.33)
SDA(18): length 34.3
  Top Layer w0.254: LCD1.4 64.16,61.28 64.16,57.09 ; 64.16,57.09 64.16,51.88 ; 64.16,57.09 64.16,51.88 ; 64.16,51.88 v1(66.15,49.89)
  Bottom Layer w0.254: v1(66.15,49.89) 73.05,42.99 73.05,38.54 73.18,38.42
$1N12886: length 45.4
  Top Layer w1.2: 74BAT1.1 42.35,3.66 44.33,6.14 v1(44.22,23.94)
  Bottom Layer w1.2: 74BAT2.2 28.85,39.31 v1(44.22,23.94)
BTRX(0): length 14.1
  Top Layer w0.4: HC05.5 87.02,56.96 87.78,56.96 90.83,53.91 U31.0
BTTX(1): length 11.4
  Top Layer w0.3: 79.69,58.53 83.04,58.53 85.88,55.69 87.53,55.69 88.29,54.93 U31.1
M1SLEEP(3.3V): length 3.8
  Top Layer w0.254: U25.7 27.1,14.54 R77.1
M2SLEEP(3.3V): length 4.5
  Top Layer w0.254: 106.67,16.18 106.67,15.68 107.12,15.23 107.77,15.23 108.6,13.89 U26.7
SCL(19): length 31.6
  Top Layer w0.3: LCD1.3 60.03,56.92 61.62,56.2 61.62,51.75 63.6,49.77 U31.19
$1N12804: length 7.9
  Top Layer w0.8: U5.3 48.43,160.46 51.39,160.46 53.11,158.74
$1N12805: length 6.9
  Top Layer w0.8: U4.3 38.78,158.3 41.43,158.3 42.57,157.16 42.57,156.91
$1N12816: length 8
  Top Layer w0.5: 13.36,148.38 13.36,149.88 13.91,150.43 17.4,150.4 19.06,150.43 19.46,150.03
$1N12817: length 7
  Top Layer w0.8: U3.3 26.82,155.11 R66.1
$1N12824: length 7.3
  Top Layer w0.8: U1.3 5.05,145.66 8.97,145.66
$1N12829: length 4.5
  Top Layer w0.4: HC05.4 78.26,58.85 R79.2
$1N12830: length 4.4
  Top Layer w0.4: HC05.3 75.72,58.74
$1N12842: length 3.5
  Top Layer w0.254: 68.23,141.25 70.6,141.25 71.4,140.45
$1N12844: length 4.2
  Top Layer w0.254: 68.23,118.26 69.26,118.26 R62.2
$1N12845: length 3.5
  Top Layer w0.254: 68.23,129.31 70.28,129.31 R61.1
$1N12852: length 6.8
  Top Layer w0.254: U18.1 67.04,147 69.22,147 R54.2
$1N12862: length 3.1
  Top Layer w0.8: R73.1 99.19,153.86 U10.3
$1N12863: length 5.1
  Top Layer w0.6: 109.3,150.71 109.3,149 109.51,148.79 112.48,148.79 U11.3
$1N12864: length 5.9
  Top Layer w0.6: R75.1 120.16,143.83 121.13,142.86 U12.3
$1N12875: length 3.4
  Top Layer w0.8: 76.06,159.76 77.89,159.76 U8.3
$1N12876: length 3.1
  Top Layer w0.8: R72.1 90.13,157.82 U9.3
$1N12883: length 5.6
  Top Layer w0.8: 57.3,161.72 59.01,160 59.01,158.59 59.93,157.67 60.42,157.67
$1N12898: length 4.3
  Top Layer w0.254: 21.54,1.92 20.22,3.24 20.22,3.62 21.49,4.89 R53.2
$1N12918: length 4.3
  Top Layer w0.8: U7.3 68.22,157.29
$1N15829: length 7.2
  Top Layer w0.3: 15.27,15.4 16.13,14.54 U25.2
$1N15830: length 7.3
  Top Layer w0.3: 15.27,12.86 19.41,12.86 20.59,14.04 U25.3
$1N16024: length 4.2
  Top Layer w0.254: U26.2 112.97,13.89 113.69,12.76 115.22,12.76 MOTOR2.2
$1N16025: length 3.9
  Top Layer w0.254: U26.3 111.96,14.39 112.88,15.31 MOTOR2.1

## Copper pours and planes (outline as drawn; the poured copper is in the pictures)
GND on Bottom Layer: -7.47,175.07 140.74,175.07 140.74,-3.62 -7.47,-3.62

## Text on the board
Bottom Silkscreen Layer: DRV8803 LFR Bot
